# Altium project Load_Cell.PrjPcb
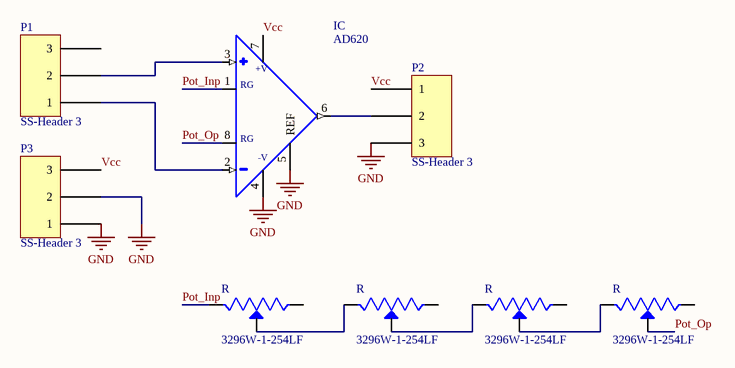
[diagram p0: Load_Cell_2.SchDoc]
1 sheet, 8 parts. Net scope: global (net labels, ports and power ports of the same name join across sheets).
Board file: Load_Cell_2.PcbDoc

## Sheet Load_Cell_2.SchDoc
size A4

### Parts
(Parts that share a designator on the sheet are numbered #1, #2 ... from top to bottom, then left to right.)
IC  AD620  [DIL08]
P1  SS-Header 3  [PCBComponent_1]
P2  SS-Header 3  [PCBComponent_1]
P3  SS-Header 3  [PCBComponent_1]
R#1  3296W-1-254LF  [TRIM_3296W-1-254LF]
R#2  3296W-1-254LF  [TRIM_3296W-1-254LF]
R#3  3296W-1-254LF  [TRIM_3296W-1-254LF]
R#4  3296W-1-254LF  [TRIM_3296W-1-254LF]

### Nets
GND: IC.4(-V) IC.5(REF) P2.3 P3.1 P3.2
Pot_Inp: IC.1(RG@1) R#1.3(CW)
Pot_Op: IC.8(RG@2) R#4.2(WIPER)
Vcc: IC.7(+V) P2.1 P3.3
NetIC_2: IC.2(NEG) P1.1
NetIC_3: IC.3(POS) P1.2
NetIC_6: IC.6(OUT) P2.2
NetR#1_2: R#1.2(WIPER) R#2.3(CW)
NetR#2_2: R#2.2(WIPER) R#3.3(CW)
NetR#3_2: R#3.2(WIPER) R#4.3(CW)

Not connected (* = marked no-connect by the designer): P1 3; R#1 1(CCW); R#2 1(CCW); R#3 1(CCW); R#4 1(CCW)

### Notes on the sheet
- (in symbol AD620) RG

### Library data of the parts
IC = AD620: Instrumentation Amplifier 1 Circuit 8-SOIC; MF: Analog Devices; Availability: Unavailable; Price: None; Package: TSSOP-8 Analog Devices; MP: AD620; Value: *; SnapEDA_Link: https://www.snapeda.com/parts/AD620/Analog%20Devices%20Inc./view-part/559692/?ref=snap
P1-P3 = Component_1: Slimseal 3-Pin Connector
R#1-R#4 = 3296W-1-254LF: 250 kOhms 0.5W, 1/2W PC Pins Through Hole Trimmer Potentiometer Cermet 25 Turn Top Adjustment; MF: Bourns; Package: SOT-23-5 Bourns; Value: *; Availability: Unavailable; SnapEDA_Link: https://www.snapeda.com/parts/3296W-1-254LF/Bourns%20-%20J.W.%20Miller/view-part/231802/?ref=snap; Price: None; MP: 3296W-1-254LF